# EAGLE design MultiWiiChassis (EAGLE 6.4)
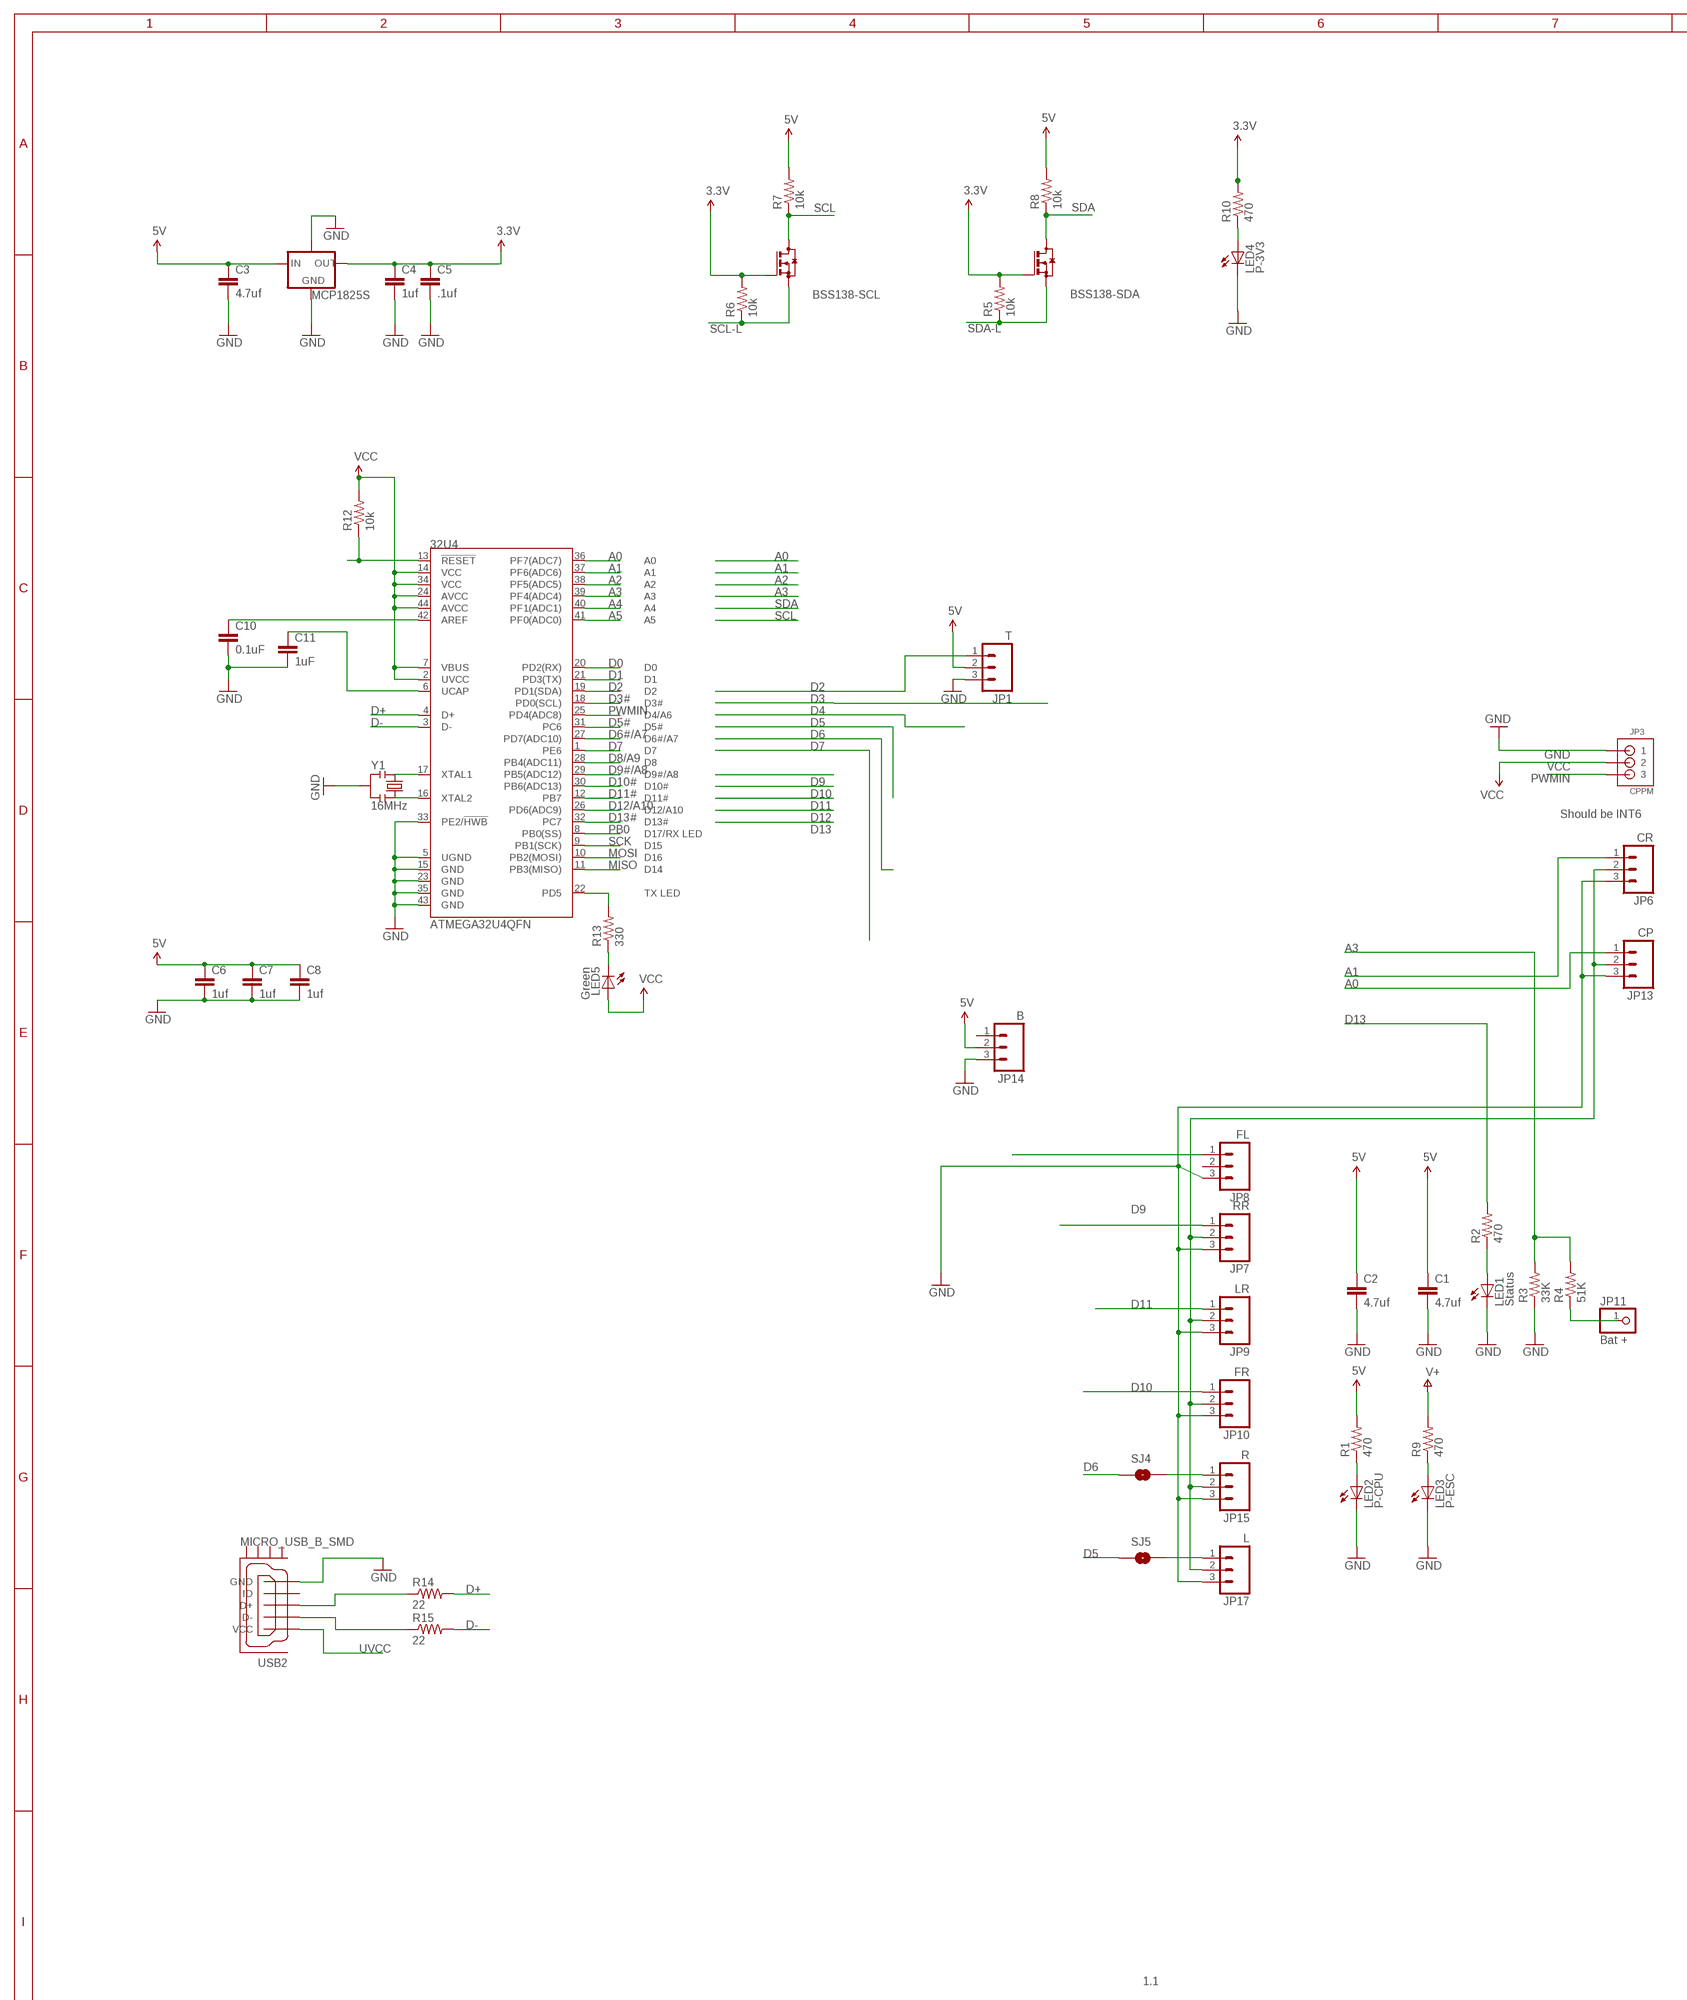
[diagram p0: schematic, sheet 1, part 1 of 2]
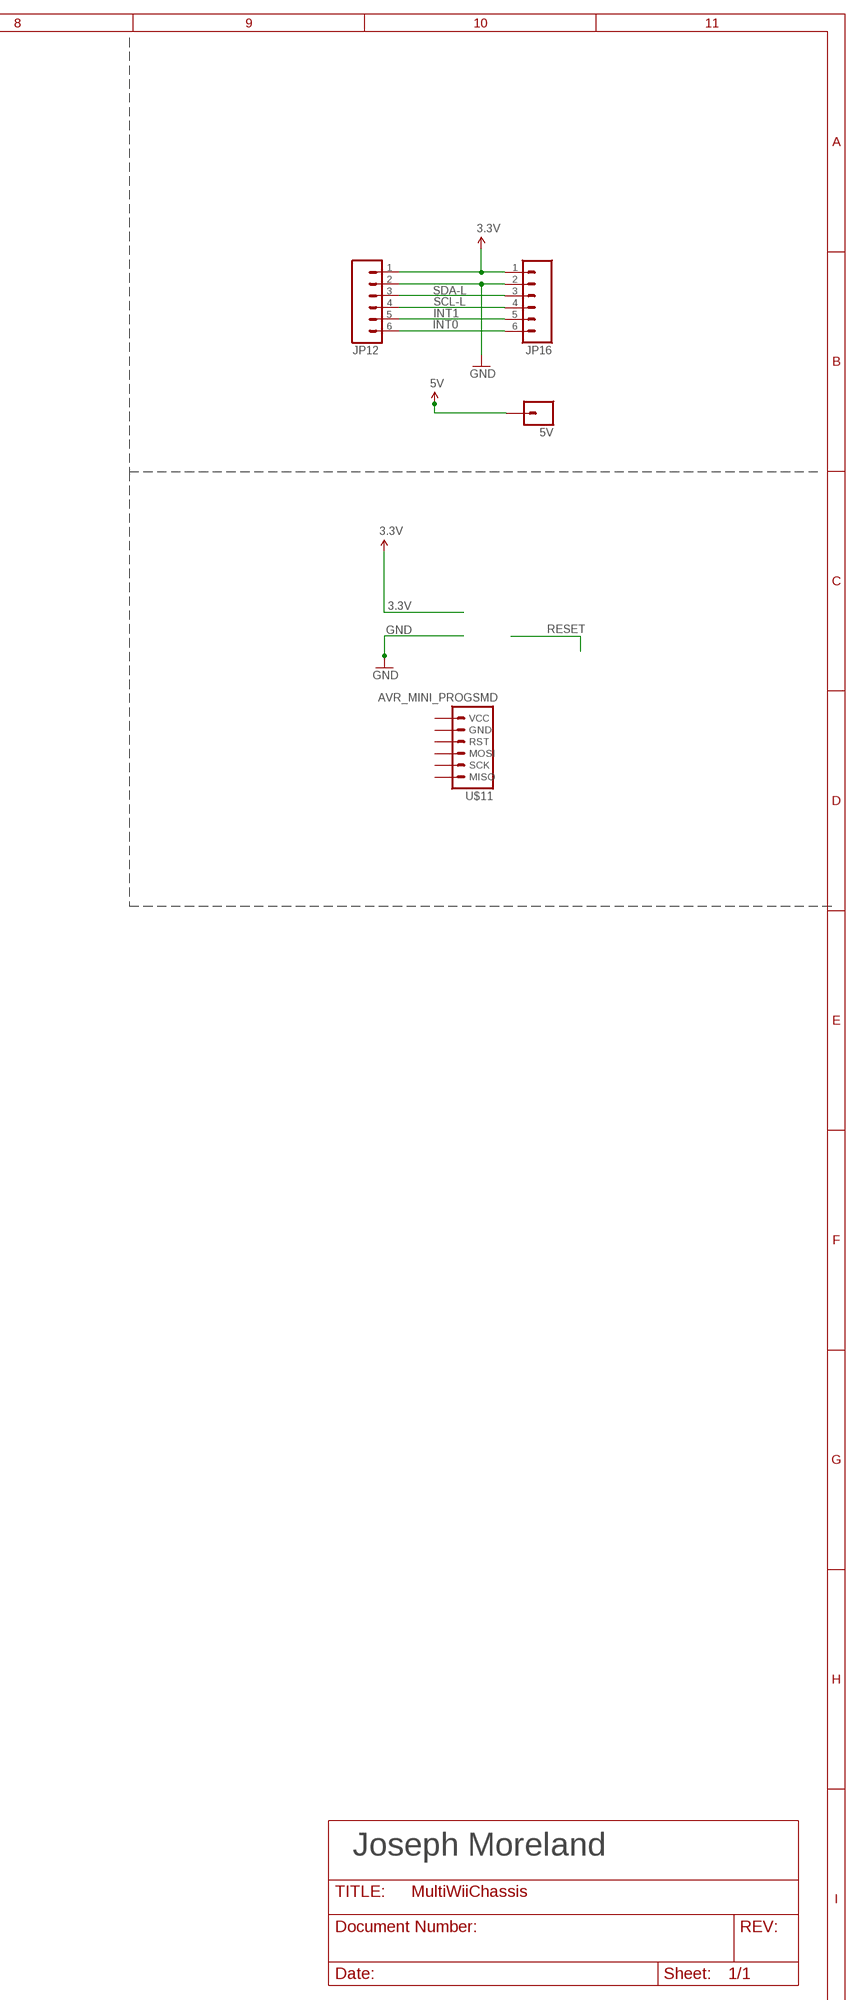
[diagram p1: schematic, sheet 1, part 2 of 2]

## Parts
5V  M01PTH  [1X01]
32U4  ATMEGA32U4QFN  [SPARKFUN-DIGITALIC_QFN-44]
BSS138-SCL  BSS138BOTTOM  [SOT23_BOT]
BSS138-SDA  BSS138BOTTOM  [SOT23_BOT]
C1  4.7uf  CAP0603-CAP  [0603-CAP]
C2  4.7uf  CAP0603-CAP  [0603-CAP]
C3  4.7uf  CAP0603-CAP  [0603-CAP]
C4  1uf  CAP0603-CAP  [0603-CAP]
C5  .1uf  CAP0603-CAP  [0603-CAP]
C6  1uf  CAP0603-CAP  [0603-CAP]
C7  1uf  CAP0603-CAP  [0603-CAP]
C8  1uf  CAP0603-CAP  [0603-CAP]
C10  0.1uF  CAP0603-CAP  [0603-CAP]
C11  1uF  CAP0402-CAP  [0402-CAP]
JP1  T  M03PTH  [1X03]
JP3  CPPM  B3B-ZR  [B3B-ZR]
JP6  CR  M03PTH  [1X03]
JP7  RR  M03PTH  [1X03]
JP8  FL  M03PTH  [1X03]
JP9  LR  M03PTH  [1X03]
JP10  FR  M03PTH  [1X03]
JP11  Bat +  PINHD-1X1  [1X01]
JP12  M06LOCK  [1X06_LOCK]
JP13  CP  M03PTH  [1X03]
JP14  B  M03PTH  [1X03]
JP15  R  M03PTH  [1X03]
JP16  M06LOCK  [1X06_LOCK]
JP17  L  M03PTH  [1X03]
LED1  Status  LED1206  [LED-1206]
LED2  P-CPU  LED1206  [LED-1206]
LED3  P-ESC  LED1206  [LED-1206]
LED4  P-3V3  LED1206  [LED-1206]
LED5  Green  LED0603  [LED-0603]
MCP1825S  V_REG_MCP1825S  V_REG_MCP1825SBOTTOM  [SOT223_BOT]
R1  470  RESISTOR0603-RES  [0603-RES]
R2  470  RESISTOR0603-RES  [0603-RES]
R3  33K  RESISTOR0603-RES  [0603-RES]
R4  51K  RESISTOR0805-RES  [0805]
R5  10k  RESISTOR0805-RES  [0805]
R6  10k  RESISTOR0805-RES  [0805]
R7  10k  RESISTOR0805-RES  [0805]
R8  10k  RESISTOR0805-RES  [0805]
R9  470  RESISTOR0805-RES  [0805]
R10  470  RESISTOR0805-RES  [0805]
R12  10k  RESISTOR0402-RES  [0402-RES]
R13  330  RESISTOR0402-RES  [0402-RES]
R14  22  RESISTOR0402-RES  [0402-RES]
R15  22  RESISTOR0402-RES  [0402-RES]
SJ4  SOLDERJUMPERNO  [SJ_2S-NO]
SJ5  SOLDERJUMPERNO  [SJ_2S-NO]
U$11  AVR_MINI_PROGSMD  [AVR_MINI_PROG]
USB2  MICRO_USB_B_SMD  [MOLEX_MICRO_USB_B_BOTTOM_MOUNT]
Y1  16MHz  RESONATOR16MHZ  [RESONATOR-SMD]

## Nets
3.3V: BSS138-SCL.G BSS138-SDA.G C4.1 C5.1 JP12.1 JP16.1 MCP1825S.3(OUT) R5.2 R6.2 R10.2
5V: 5V.1 C1.1 C2.1 C3.1 C6.1 C7.1 C8.1 JP1.2 JP14.2 MCP1825S.1(IN) R1.2 R7.2 R8.2
A0: 32U4.36(PF7(ADC7)) JP13.1
A1: 32U4.37(PF6(ADC6)) JP6.1
A2: 32U4.38(PF5(ADC5))
A3: 32U4.39(PF4(ADC4)) R3.2 R4.2
A4: 32U4.40(PF1(ADC1))
A5: 32U4.41(PF0(ADC0))
AREF1: 32U4.42(AREF) C10.1
D0: 32U4.20(PD2(RX))
D1: 32U4.21(PD3(TX))
D2: 32U4.19(PD1(SDA)) JP1.1
D3: JP8.1
D3#: 32U4.18(PD0(SCL))
D5: SJ5.1
D5#: 32U4.31(PC6)
D6: SJ4.1
D6#/A7: 32U4.27(PD7(ADC10))
D7: 32U4.1(PE6)
D8/A9: 32U4.28(PB4(ADC11))
D9: JP7.1
D9#/A8: 32U4.29(PB5(ADC12))
D10: JP10.1
D10#: 32U4.30(PB6(ADC13))
D11: JP9.1
D11#: 32U4.12(PB7)
D12/A10: 32U4.26(PD6(ADC9))
D13: R2.2
D13#: 32U4.32(PC7)
D+: 32U4.4(D+) R14.2
D-: 32U4.3(D-) R15.2
GND: 32U4.5(UGND) 32U4.15(GND) 32U4.23(GND) 32U4.33(PE2/!HWB) 32U4.35(GND) 32U4.43(GND) C1.2 C2.2 C3.2 C4.2 C5.2 C6.2 C7.2 C8.2 C10.2 C11.2 JP1.3 JP3.1 JP6.3 JP7.3 JP8.3 JP9.3 JP10.3 JP12.2 JP13.3 JP14.3 JP15.3 JP16.2 JP17.3 LED1.C LED2.C LED3.C LED4.C MCP1825S.2(GND) MCP1825S.GNDPAD R3.1 USB2.5(GND) Y1.2
INT0: JP12.6 JP16.6
INT1: JP12.5 JP16.5
MISO: 32U4.11(PB3(MISO))
MOSI: 32U4.10(PB2(MOSI))
N$1: LED1.A R2.1
N$2: LED2.A R1.1
N$3: JP11.1 R4.1
N$4: 32U4.17(XTAL1) Y1.1
N$6: 32U4.16(XTAL2) Y1.3
N$7: R14.1 USB2.3(D+)
N$8: LED5.C R13.1
N$9: JP15.1 SJ4.2
N$11: R15.1 USB2.2(D-)
N$13: LED4.A R10.1
N$16: LED3.A R9.1
N$18: JP17.1 SJ5.2
N$33: 32U4.22(PD5) R13.2
PB0: 32U4.8(PB0(SS))
PWMIN: 32U4.25(PD4(ADC8)) JP3.3
RESET1: 32U4.13(!RESET) R12.1
SCK: 32U4.9(PB1(SCK))
SCL: BSS138-SCL.D R7.1
SCL-L: BSS138-SCL.S JP12.4 JP16.4 R6.1
SDA: BSS138-SDA.D R8.1
SDA-L: BSS138-SDA.S JP12.3 JP16.3 R5.1
UCAP: 32U4.6(UCAP) C11.1
UVCC: USB2.1(VCC)
VCC: 32U4.2(UVCC) 32U4.7(VBUS) 32U4.14(VCC) 32U4.24(AVCC) 32U4.34(VCC) 32U4.44(AVCC) JP3.2 LED5.A R12.2
VESC: JP6.2 JP7.2 JP9.2 JP10.2 JP13.2 JP15.2 JP17.2 R9.2 ; supply symbol labelled V+
Unconnected: JP8.2 JP14.1 U$11.1(VCC) U$11.2(GND) U$11.3(RST) U$11.4(MOSI) U$11.5(SCK) U$11.6(MISO) USB2.4(ID) USB2.GND1 USB2.GND2 USB2.GND3 USB2.GND4

## Notes on the sheet
- Should be INT6
- Joseph Moreland
- 1.1

## Library data of the parts
5V = SparkFun:M01: Header 1 Standard 1-pin 0.1" header. Use with straight break away headers (SKU : PRT-00116), right angle break away headers (PRT-00553), swiss pins (PRT-00743), machine pins (PRT-00117), and female headers (PRT-00115).
32U4 = SparkFun-DigitalIC:ATMEGA32U4: Atmel 44-pin 8-bit Microcontroller with 32KBytes of ISP Flash and USB Controller; PARTNO: ATMEGA32U4-MU
BSS138-SCL BSS138-SDA = JCM:BSS138
C1-C8 = SparkFun:CAP: Capacitor Standard 0603 ceramic capacitor, and 0.1" leaded capacitor.
C10 = SparkFun-Capacitors:CAP: Capacitor Standard 0603 ceramic capacitor, and 0.1" leaded capacitor.; PARTNO: C0603C104K8RACTU
C11 = SparkFun-Capacitors:CAP: Capacitor Standard 0603 ceramic capacitor, and 0.1" leaded capacitor.; PARTNO: LMK105BJ105KV-F
JP1 JP6-JP10 JP13-JP15 JP17 = SparkFun:M03: Header 3 Standard 3-pin 0.1" header. Use with straight break away headers (SKU : PRT-00116), right angle break away headers (PRT-00553), swiss pins (PRT-00743), machine pins (PRT-00117), and female headers (PRT-00115). Molex polarized connector foot print use with SKU : PRT-08232 with associated crimp pins and housings.
JP3 = jst-zh-dl:B3B-ZR: JST-ZH Connector 3 pol, 1.5mm pitch Package: B3B-ZR Source: http://www.jst-mfg.com/product/pdf/eng/eZH.pdf; PARTNO: M20-9990346
JP11 = pinhead:PINHD-1X1: PIN HEADER
JP12 JP16 = SparkFun:M06: Header 6 Standard 6-pin 0.1" header. Use with straight break away headers (SKU : PRT-00116), right angle break away headers (PRT-00553), swiss pins (PRT-00743), machine pins (PRT-00117), and female headers (PRT-00115). Molex polarized connector foot print use with SKU : PRT-08094 with associated crimp pins and housings. NOTES ON THE VARIANTS LOCK and LOCK_LONGPADS... This footprint was designed to help hold the alignment of a through-hole component (i.e. 6-pin header) while soldering it into place. You may notice that each hole has been shifted either up or down by 0.005 of an inch from it's more standard position (which is a perfectly straight line). This slight alteration caused the pins (the squares in the middle) to touch the edges of the holes. Because they are alternating, it causes a "brace" to hold the component in place. 0.005 has proven to be the perfect amount of "off-center" position when using our standard breakaway headers. Although looks a little odd when you look at the bare footprint, once you have a header in there, the alteration is very hard to notice. Also, if you push a header all the way into place, it is covered up entirely on the bottom side. This idea of altering the position of holes to aid alignment will be further integrated into the Sparkfun Library for other footprints. It can help hold any component with 3 or more connection pins.
LED1-LED4 = SparkFun:LED: LEDs Standard schematic elements and footprints for 5mm, 3mm, 1206, and 0603 sized LEDs. 5mm - Spark Fun Electronics SKU : COM-00529 (and others)
LED5 = SparkFun-LED:LED: LEDs Standard schematic elements and footprints for 5mm, 3mm, 1206, and 0603 sized LEDs. 5mm - Spark Fun Electronics SKU : COM-00529 (and others); PARTNO: LTST-C190KGKT
MCP1825S = JCM:V_REG_MCP1825S: MCP1825S (ww1.microchip.com/downloads/en/DeviceDoc/22056b.pdf) - 500 mA, Low Voltage, Low Quiescent Current LDO Regulator
R1-R10 = SparkFun:RESISTOR: Resistor Basic schematic elements and footprints for 0603, 1206, and PTH resistors.
R12 = SparkFun-Resistors:RESISTOR: Resistor Basic schematic elements and footprints for 0603, 1206, and PTH resistors.; PARTNO: CRCW040210K0FKED
R13 = SparkFun-Resistors:RESISTOR: Resistor Basic schematic elements and footprints for 0603, 1206, and PTH resistors.; PARTNO: CRCW0402330RJNED
R14 R15 = SparkFun-Resistors:RESISTOR: Resistor Basic schematic elements and footprints for 0603, 1206, and PTH resistors.; PARTNO: CRCW040222R0JNED
SJ4 SJ5 = SparkFun:SOLDERJUMPER: Solder Jumper Standard SMD solder jumper. Used to automate production. Two varients : Normally Open and Normally Closed are the same, but have different paste layers. NC will have a large amount of paste and should jumper during reflow.
U$11 = SparkFun-Connectors:AVR_MINI_PROG: AVR ISP 6-pin inline header
USB2 = JCM:MICRO_USB_B_SMD: Molex Micro USB B Receptacle, bottom mount Micro-USB technology was developed by the USB Implementers Forum, Inc. (USB-IF), an independent nonprofit group that advances USB technology. Molex's Micro-USB connectors offer advantages of smaller size and increased durability compared with the Mini-USB. Micro-USB connectors allow manufacturers to push the limits of thinner and lighter mobile devices with sleeker designs and greater portability.; DATASHEET: http://www.molex.com/webdocs/datasheets/pdf/en-us/0473460001_IO_CONNECTORS.pdf; LINK: http://www.molex.com/molex/products/family?key=micro_usb&channel=products&chanName=family&pageTitle=Introduction; MFGPN: 47346-0001; PARTNO: 473460001
Y1 = SparkFun-FreqCtrl:RESONATOR: Resonator Small SMD resonator. Used, eg, on the Arduino Pro/ Pro Mini boards. 8MHz- XTAL-08895 16MHz- XTAL-08900; PARTNO: CSTCE16M0V53-R0; PROD_ID: XTAL-08900

## Board
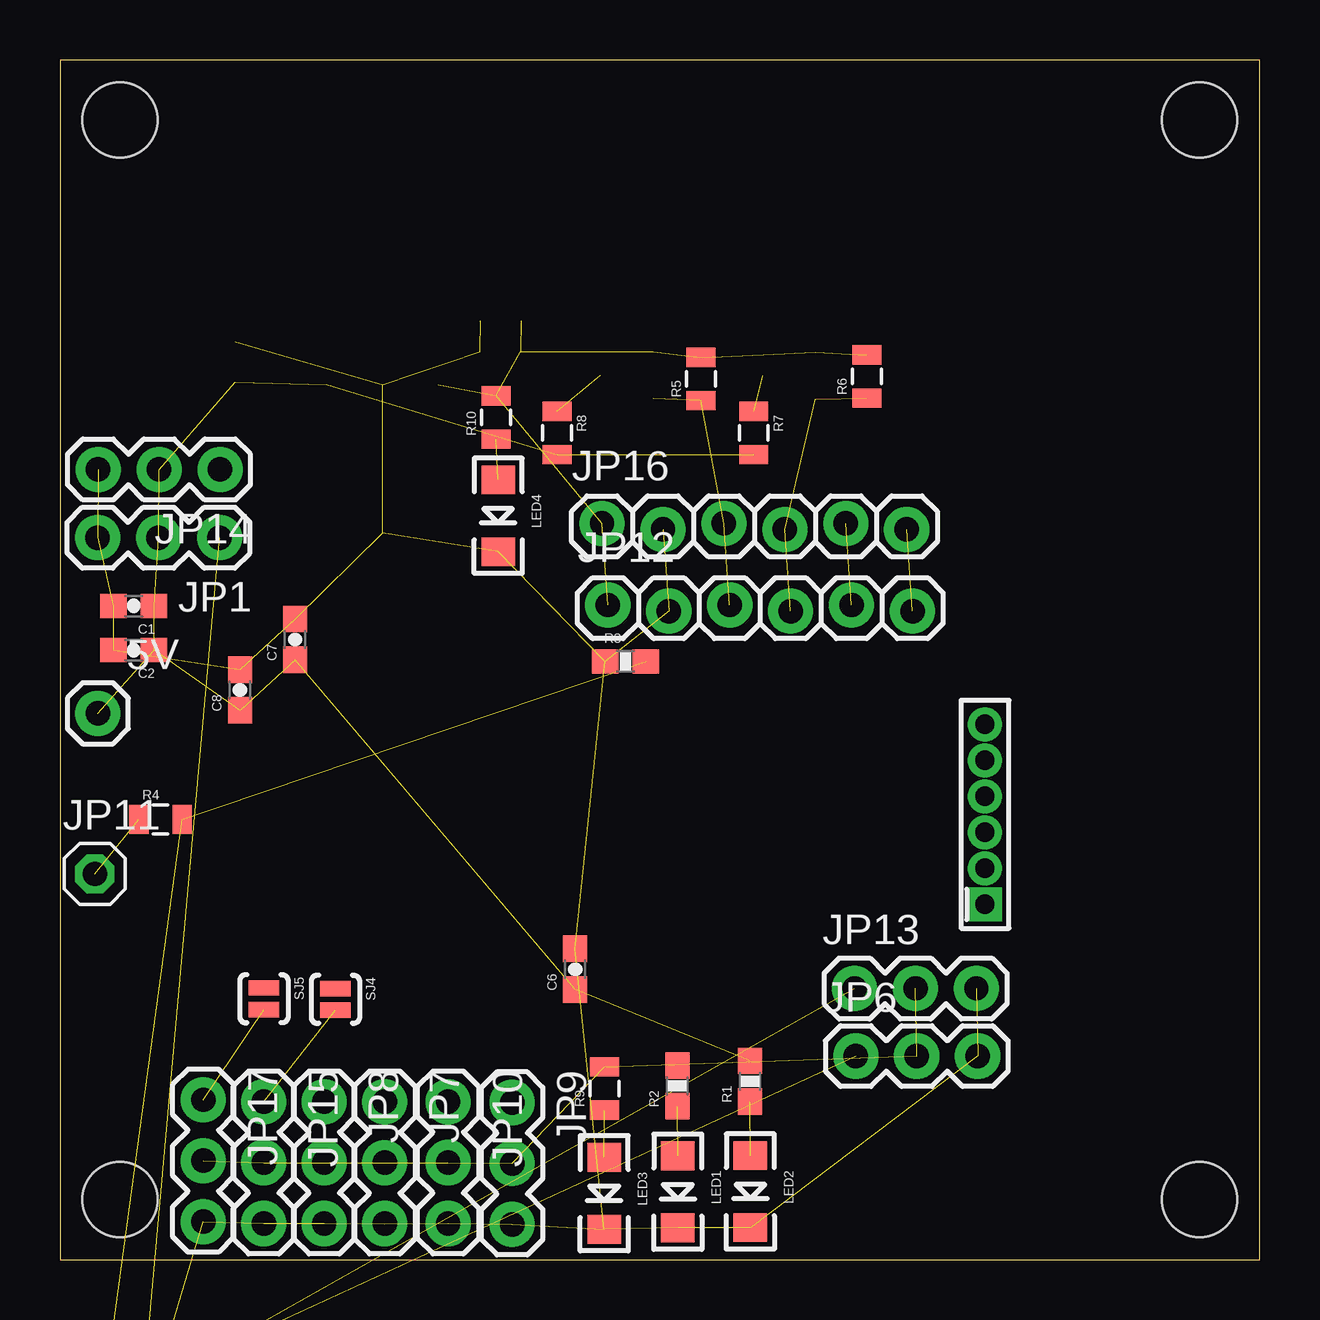
[diagram p2: board, top side]
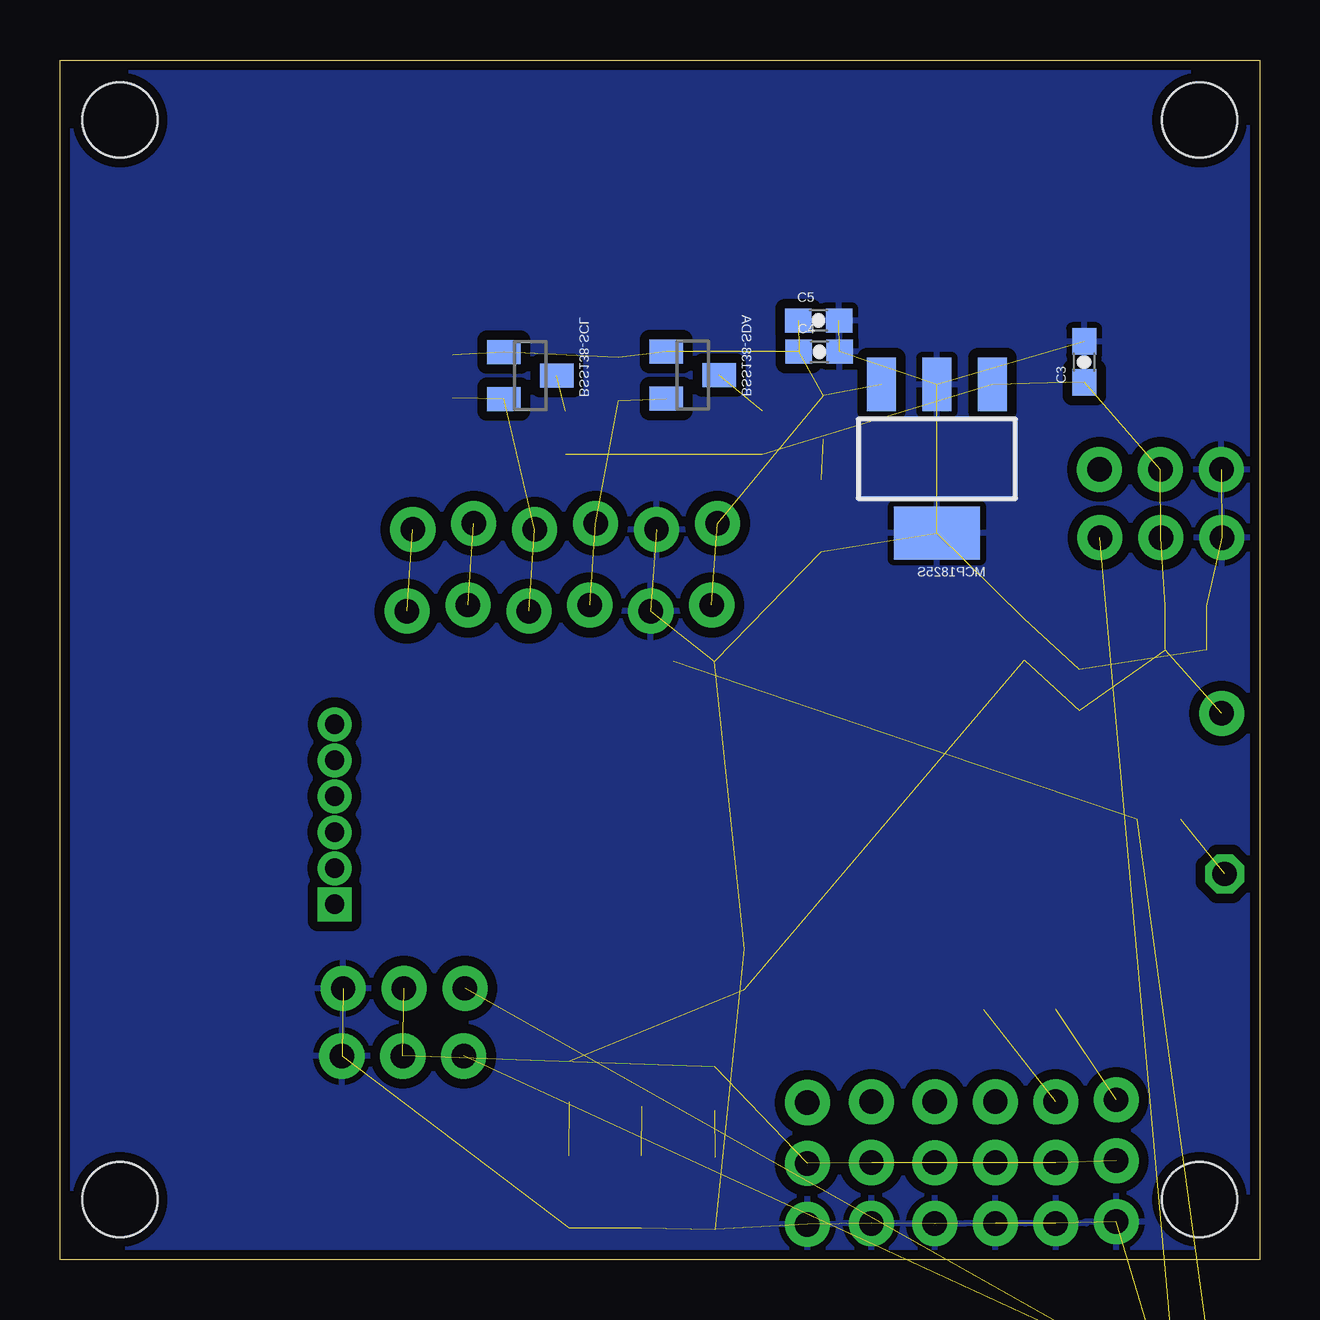
[diagram p3: board, bottom side, seen from below]

Size 50 x 50 mm. Coordinates in mm from the lower left corner, seen from the top.
Outline: 0,50 0,0 50,0 50,50 0,50
Copper layers (1*16): Top 0.035mm / dielectric 1.5mm / Bottom 0.035mm
Design rules "default": minimum track width 8mil, minimum drill 20mil, track to track 8mil, track to pad 8mil, pad to pad 8mil, via to via 8mil, smd to smd 8mil, copper to edge 10mil, drill to drill 8mil, minimum pad ring 12mil, minimum via ring 10mil, stop-mask expansion 4mil, vias tented up to drill 25mil, thermal gap 10mil
Holes 3.12 mm at 47.5,47.5 2.5,47.5 2.5,2.5 47.5,2.5

### Footprints (pad centres in the part's own frame; a part is rotated, then mirrored left to right if it is on the bottom)
1X01 = drill 1.016 pad 1.88: 1 0,0
SPARKFUN-DIGITALIC_QFN-44 = smd 0.8 x 0.3: 1 -3.4,2.5; 2 -3.4,2; 3 -3.4,1.5; 4 -3.4,1; 5 -3.4,0.5; 6 -3.4,0; 7 -3.4,-0.5; 8 -3.4,-1; 9 -3.4,-1.5; 10 -3.4,-2; 11 -3.4,-2.5; 23 3.4,-2.5; 24 3.4,-2; 25 3.4,-1.5; 26 3.4,-1; 27 3.4,-0.5; 28 3.4,0; 29 3.4,0.5; 30 3.4,1; 31 3.4,1.5; 32 3.4,2; 33 3.4,2.5 | smd 0.3 x 0.8: 12 -2.5,-3.4; 13 -2,-3.4; 14 -1.5,-3.4; 15 -1,-3.4; 16 -0.5,-3.4; 17 0,-3.4; 18 0.5,-3.4; 19 1,-3.4; 20 1.5,-3.4; 21 2,-3.4; 22 2.5,-3.4; 34 2.5,3.4; 35 2,3.4; 36 1.5,3.4; 37 1,3.4; 38 0.5,3.4; 39 0,3.4; 40 -0.5,3.4; 41 -1,3.4; 42 -1.5,3.4; 43 -2,3.4; 44 -2.5,3.4
SOT23_BOT = smd 1 x 1.4 bottom: D 0,1.1; G 0.98,-1.1; S -0.98,-1.1
0603-CAP = smd 1.1 x 1: 1 -0.85,0; 2 0.85,0
0402-CAP = smd 0.7 x 0.9: 1 -0.65,0; 2 0.65,0
1X03 = drill 1.016 pad 1.88: 1 0,0; 2 2.54,0; 3 5.08,0
B3B-ZR = drill 0.7 pad 1.1: 1 -1.5,0; 2 0,0; 3 1.5,0
1X01' = drill 1.016 octagon: 1 0,0
1X06_LOCK = drill 1.016 pad 1.88: 1 0,0; 2 2.54,-0.254; 3 5.08,0; 4 7.62,-0.254; 5 10.16,0; 6 12.7,-0.254
LED-1206 = smd 1.2 x 1.4: A -1.5,0; C 1.5,0
LED-0603 = smd 0.8 x 0.8: A 0,-0.75; C 0,0.75
SOT223_BOT = smd 1.219 x 2.235 bottom: 1 2.311,-3.099; 2 0,-3.099; 3 -2.311,-3.099 | smd 3.6 x 2.2 bottom: GNDPAD 0,3.099
0603-RES = smd 1.1 x 1: 1 -0.85,0; 2 0.85,0
0805 = smd 0.8 x 1.2: 1 -0.9,0; 2 0.9,0
0402-RES = smd 0.7 x 0.9: 1 -0.65,0; 2 0.65,0
SJ_2S-NO = smd 0.635 x 1.27: 1 -0.45,0; 2 0.45,0
AVR_MINI_PROG = drill 0.8 pad 1.27 square: 1 0,0 | drill 0.8 pad 1.27: 2 1.5,0; 3 3,0; 4 4.5,0; 5 6,0; 6 7.5,0.01
MOLEX_MICRO_USB_B_BOTTOM_MOUNT = smd 1.7 x 0.45: 1 2.8,1.3; 2 2.8,0.65; 3 2.8,0; 4 2.8,-0.65; 5 2.8,-1.3 | smd 1.9 x 2.375: GND1 0,2.95; GND4 0,-2.95 | smd 2.1 x 1.475: GND2 2.3,2.5; GND3 2.3,-2.5
RESONATOR-SMD = smd 0.7 x 1.7: 1 -1.2,0; 2 0,0; 3 1.2,0

### Placement (x,y rotation side)
5V  1.58,22.77 0 top
32U4  1.85,-8.86 0 top  (outside the outline)
BSS138-SCL  30.39,36.84 90 top
BSS138-SDA  23.62,36.87 90 top
C1  3.07,27.24 180 top
C2  3.07,25.4 180 top
C3  7.3,37.41 90 bottom
C4  18.35,37.83 0 bottom
C5  18.38,39.14 0 bottom
C6  21.48,12.1 90 top
C7  9.8,25.85 90 top
C8  7.5,23.74 90 top
C10  9.53,-16.84 0 top  (outside the outline)
C11  12.62,-16.79 0 top  (outside the outline)
JP1  6.65,30.09 180 top
JP3  2.21,-32.69 0 top  (outside the outline)
JP6  33.17,8.48 0 top
JP7  13.54,6.58 270 top
JP8  11.01,6.58 270 top
JP9  18.85,6.54 270 top
JP10  16.18,6.58 270 top
JP11  Bat +  [1X01']  1.45,16.08 0 top
JP12  22.84,27.28 0 top
JP13  33.12,11.3 0 top
JP14  6.67,32.93 180 top
JP15  8.49,6.58 270 top
JP16  22.59,30.68 0 top
JP17  5.98,6.66 270 top
LED1  25.76,2.82 270 top
LED2  28.78,2.83 270 top
LED3  22.68,2.76 270 top
LED4  18.26,31 270 top
LED5  11.56,-27.86 0 top  (outside the outline)
MCP1825S  13.45,33.38 180 top
R1  28.77,7.43 90 top
R2  25.73,7.24 90 top
R3  23.57,24.93 0 top
R4  4.19,18.34 0 top
R5  26.72,36.7 90 top
R6  33.63,36.81 90 top
R7  28.92,34.46 270 top
R8  20.71,34.46 270 top
R9  22.7,7.13 90 top
R10  18.17,35.1 90 top
R12  -0.48,-27.81 0 top  (outside the outline)
R13  2.62,-27.81 0 top  (outside the outline)
R14  5.72,-27.81 0 top  (outside the outline)
R15  8.81,-27.81 0 top  (outside the outline)
SJ4  11.48,10.85 270 top
SJ5  8.5,10.87 270 top
U$11  38.56,14.81 90 top
USB2  0.28,-21.82 0 top  (outside the outline)
Y1  6.07,-17.35 0 top  (outside the outline)

### Tracks (layer width: path | path; a pad name or v marks a point on that pad's centre or on a via)
3.3V  (9 unrouted)
5V  (12 unrouted)
A0  (1 unrouted)
A1  (1 unrouted)
A3  (2 unrouted)
AREF1  (1 unrouted)
D2  (1 unrouted)
D+  (1 unrouted)
D-  (1 unrouted)
GND  (37 unrouted)
  pour Bottom (isolate 0.406): -1.98,-1.36 -0.93,51.23 52.47,51.13 51.27,-2.26
INT0  (1 unrouted)
INT1  (1 unrouted)
N$1  (1 unrouted)
N$2  (1 unrouted)
N$3  (1 unrouted)
N$4  (1 unrouted)
N$6  (1 unrouted)
N$7  (1 unrouted)
N$8  (1 unrouted)
N$9  (1 unrouted)
N$11  (1 unrouted)
N$13  (1 unrouted)
N$16  (1 unrouted)
N$18  (1 unrouted)
N$33  (1 unrouted)
PWMIN  (1 unrouted)
RESET1  (1 unrouted)
SCL  (1 unrouted)
SCL-L  (3 unrouted)
SDA  (1 unrouted)
SDA-L  (3 unrouted)
UCAP  (1 unrouted)
VCC  (8 unrouted)
VESC  (7 unrouted)